# Altium schematic sheet Sheet3.SchDoc
size A; SheetNumber: 2; SheetTotal: 1
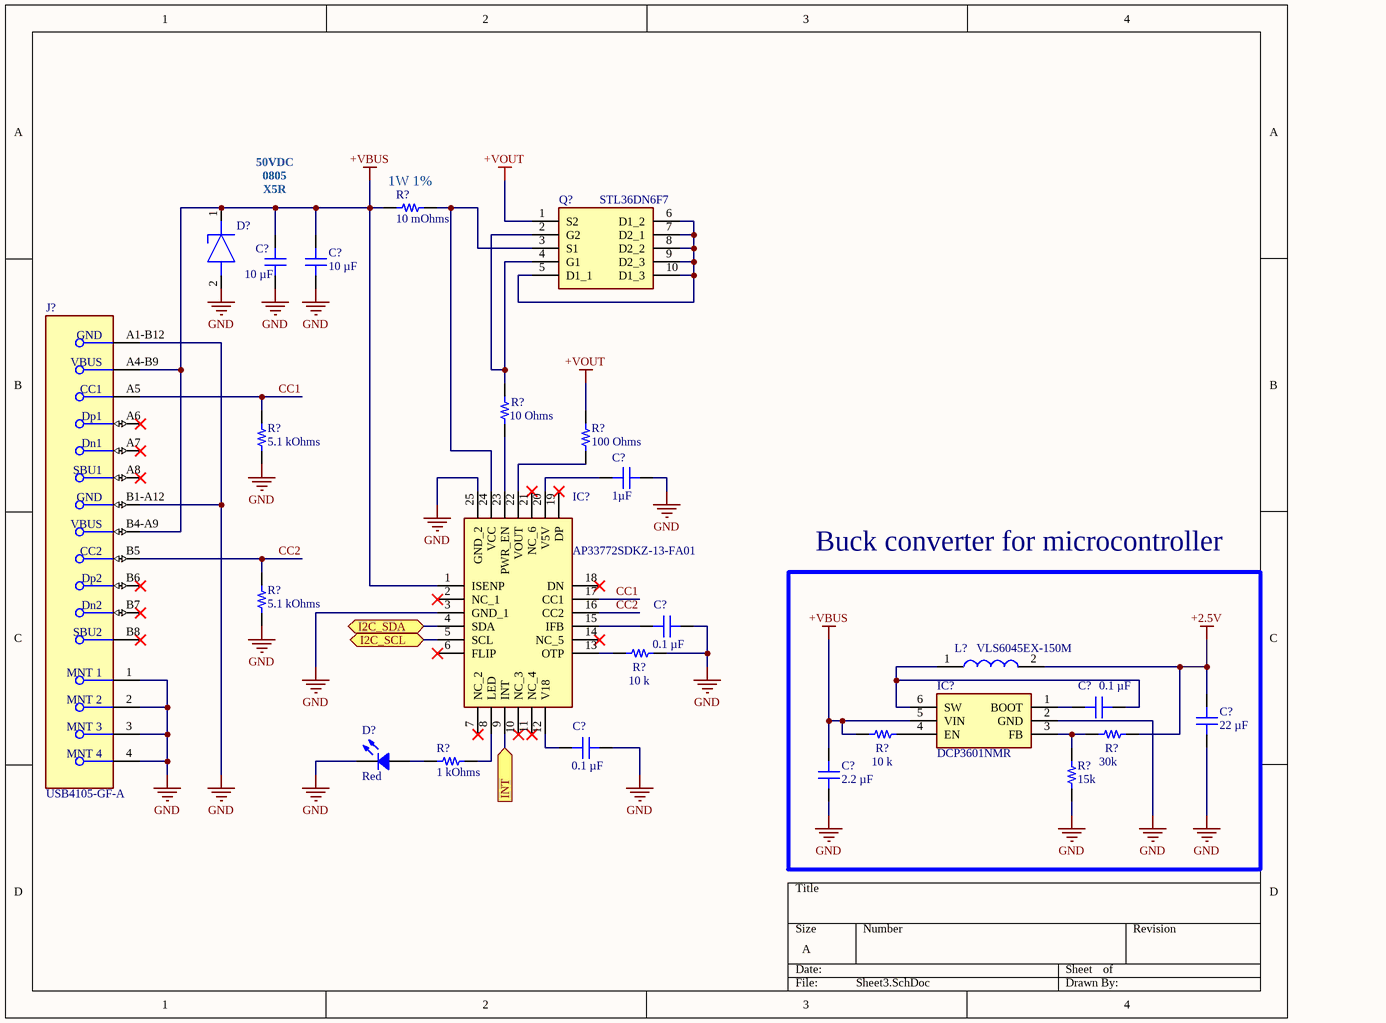
[diagram p0: Sheet3.SchDoc]

## Parts
(Parts that share a designator on the sheet are numbered #1, #2 ... from top to bottom, then left to right.)
C?#1  10 µF  [MURATA GRM21B 0805_2012]
C?#2  10 µF  [MURATA GRM21B 0805_2012]
C?#3  1µF  [CAP 0805_2012]
C?#4  0.1 µF  [CAP 0805_2012]
C?#5  0.1 µF  [CAP 0805_2012]
C?#6  22 µF  [CAP 1206_3216 - 0.8MM]
C?#7  0.1 µF  [CAP 0805_2012]
C?#8  2.2 µF  [CAP 1206_3216 - 0.8MM]
D?#1  PESD24VS1UA,115  [SOD2512X110N]  (value not drawn)
D?#2  Red  [LED 1206_3216 RED]
IC?#1  AP33772SDKZ-13-FA01  [AP33772SDKZ13FA01]
IC?#2  DCP3601NMR  [SOT95P280X125-6N]
J?  USB4105-GF-A  [FP-USB4105-GF-A-MFG]
L?  VLS6045EX-150M  [VLS6045]
Q?  STL36DN6F7  [STL36DN6F7]
R?#1  10 mOhms  [RES 1206_3216]
R?#2  10 Ohms  [RES 0805_2012]
R?#3  5.1 kOhms  [YAGEO RES 0805_2012]
R?#4  100 Ohms  [RES 0805_2012]
R?#5  5.1 kOhms  [YAGEO RES 0805_2012]
R?#6  10 k  [RES 0805_2012]
R?#7  10 k  [RES 0805_2012]
R?#8  30k  [RES 0805_2012]
R?#9  1 kOhms  [RES 0805_2012]
R?#10  15k  [RES 0805_2012]

## Blocks framed on the sheet
Buck converter for microcontroller: C?#5 C?#6 C?#8 IC?#2 L? R?#7 R?#8 R?#10

## Ports
I2C_SCL (bidir), I2C_SDA (bidir), INT (in)

## Nets
+2.5V: C?#6.2 L?.2 R?#8.2
+VBUS: C?#1.2 C?#2.2 C?#8.2 D?#1.1(K) IC?#1.1(ISENP) IC?#2.5(VIN) J?.A4-B9(VBUS) J?.B4-A9(VBUS) R?#1.1 R?#7.1
+VOUT: Q?.1(S2) R?#4.2
GND: C?#1.1 C?#2.1 C?#3.2 C?#4.1 C?#6.1 C?#7.1 C?#8.1 D?#1.2(A) D?#2.2 IC?#1.3(GND_1) IC?#1.25(GND_2) IC?#2.2(GND) J?.1(MNT_1) J?.2(MNT_2) J?.3(MNT_3) J?.4(MNT_4) J?.A1-B12(GND) J?.B1-A12(GND) R?#3.1 R?#5.1 R?#6.2 R?#10.1
CC1: IC?#1.17(CC1) J?.A5(CC1) R?#3.2
CC2: IC?#1.16(CC2) J?.B5(CC2) R?#5.2
I2C_SCL: IC?#1.5(SCL) ; port I2C_SCL
I2C_SDA: IC?#1.4(SDA) ; port I2C_SDA
INT: IC?#1.9(INT) ; port INT
NetC?#3_1: C?#3.1 IC?#1.20(V5V)
NetC?#4_2: C?#4.2 IC?#1.15(IFB)
NetC?#5_1: C?#5.1 IC?#2.1(BOOT)
NetC?#5_2: C?#5.2 IC?#2.6(SW) L?.1
NetC?#7_2: C?#7.2 IC?#1.12(V18)
NetD?#2_1: D?#2.1 R?#9.1
NetIC?#1_8: IC?#1.8(LED) R?#9.2
NetIC?#1_13: IC?#1.13(OTP) R?#6.1
NetIC?#1_22: IC?#1.22(VOUT) R?#4.1
NetIC?#1_23: IC?#1.23(PWR_EN) R?#2.1
NetIC?#1_24: IC?#1.24(VCC) Q?.3(S1) R?#1.2
NetIC?#2_3: IC?#2.3(FB) R?#8.1 R?#10.2
NetIC?#2_4: IC?#2.4(EN) R?#7.2
NetQ?_2: Q?.2(G2) Q?.4(G1) R?#2.2
NetQ?_5: Q?.5(D1_1) Q?.6(D1_2) Q?.7(D2_1) Q?.8(D2_2) Q?.9(D2_3) Q?.10(D1_3)

Not connected (* = marked no-connect by the designer): IC?#1 2(NC_1)* 6(FLIP)* 7(NC_2)* 10(NC_3)* 11(NC_4)* 14(NC_5)* 18(DN)* 19(DP)* 21(NC_6)*; J? A6(Dp1)* A7(Dn1)* A8(SBU1)* B6(Dp2)* B7(Dn2)* B8(SBU2)*

## Notes on the sheet
- 50VDC
  0805
  X5R
- (near R?#1) 1W 1%

## Library data of the parts
C?#1 C?#2 = GRM21BR61H106KE43L: CAP CER 10UF 50V X5R 0805; manufacturer: Murata Electronics; Tolerance: ±10%; Part Number: GRM21BR61H106KE43L; Capacitance: 10 µF; Applications: Mobile Devices Only; componentlink1description: Datasheet; componentlink1url: https://search.murata.co.jp/Ceramy/image/img/A01X/G101/ENG/GRM21BR61H106KE43-01A.pdf; componentlink2description: DigiKey Link; componentlink2url: https://www.digikey.com/en/products/detail/murata-electronics/GRM21BR61H106KE43L/10326316; Device Package: 0805 (2012 Metric); lastupdated: 8/27/2024 9:29:56 AM; Lifecycle Status: Active; Minimum Order: 1; Mounting Type: Surface Mount, MLCC; Operating Temperature: -55°C ~ 85°C; Package / Case: 0805 (2012 Metric); packaging: TapeAndReel; partid: 39284; Part Status: Active; price: 0.05; series: GRM; Size / Dimension: 0.079" L x 0.049" W (2.00mm x 1.25mm); Supplier 1: DigiKey; Supplier Part Number 1: 490-18663-1-ND; Temperature Coefficient: X5R; Thickness (Max): 0.057" (1.45mm); value: 10 µF; Voltage - Rated: 50V
C?#3 = 08053C105KAT2A: CAP CER 1UF 25V X7R 0805; manufacturer: AVX Corporation; Tolerance: ±10%; Part Number: 08053C105KAT2A; Capacitance: 1µF; Applications: General Purpose; componentlink1description: Datasheet; componentlink1url: http://datasheets.avx.com/X7RDielectric.pdf; componentlink2description: DigiKey Link; componentlink2url: http://digikey.com/product-detail/en/avx-corporation/08053C105KAT2A/478-5030-1-ND/1888241; Device Package: 0805 (2012 Metric); lastupdated: 9/2/2020 1:04:33 AM; Lifecycle Status: Active; Minimum Order: 1; Mounting Type: Surface Mount, MLCC; Operating Temperature: -55°C ~ 125°C; Package / Case: 0805 (2012 Metric); packaging: TapeAndReel; partid: 7289; Part Status: Active; price: 0.04; series: -; Size / Dimension: 0.079" L x 0.049" W (2.01mm x 1.25mm); Supplier 1: DigiKey; Supplier Part Number 1: 478-5030-1-ND; Temperature Coefficient: X7R; Thickness (Max): 0.037" (0.94mm); value: 1µF; Voltage - Rated: 25V
C?#4 C?#5 C?#7 = CC0805MRX7R9BB104: CAP CER 0.1UF 50V X7R 0805; manufacturer: Yageo; Tolerance: ±20%; Part Number: CC0805MRX7R9BB104; Capacitance: 0.1 µF; Applications: General Purpose; componentlink1description: Datasheet; componentlink1url: https://www.yageo.com/upload/media/product/productsearch/datasheet/mlcc/UPY-GPHC_X7R_6.3V-to-50V_18.pdf; componentlink2description: DigiKey Link; componentlink2url: https://www.digikey.com/en/products/detail/yageo/CC0805MRX7R9BB104/5884281; Device Package: 0805 (2012 Metric); lastupdated: 2/9/2024 8:16:09 PM; Lifecycle Status: Active; Minimum Order: 1; Mounting Type: Surface Mount, MLCC; Operating Temperature: -55°C ~ 125°C; Package / Case: 0805 (2012 Metric); packaging: TapeAndReel; partid: 2475; Part Status: Active; price: 0.01; series: CC; Size / Dimension: 0.079" L x 0.049" W (2.00mm x 1.25mm); Supplier 1: DigiKey; Supplier Part Number 1: 311-4351-1-ND; Temperature Coefficient: X7R; Thickness (Max): 0.037" (0.95mm); value: 0.1 µF; Voltage - Rated: 50V
C?#6 = CL31A226MOCLNNC: CAP CER 22UF 16V X5R 1206; manufacturer: Samsung Electro-Mechanics; Tolerance: ±20%; Part Number: CL31A226MOCLNNC; Capacitance: 22 µF; Applications: General Purpose; componentlink1description: Datasheet; componentlink1url: http://www.samsungsem.com/kr/support/product-search/mlcc/CL31A226MOCLNNC.jsp; componentlink2description: DigiKey Link; componentlink2url: https://www.digikey.com/en/products/detail/samsung-electro-mechanics/CL31A226MOCLNNC/3888386; Device Package: 1206 (3216 Metric); Features: Low Profile; lastupdated: 6/4/2024 7:10:40 PM; Lifecycle Status: Active; Minimum Order: 1; Mounting Type: Surface Mount, MLCC; Operating Temperature: -55°C ~ 85°C; Package / Case: 1206 (3216 Metric); packaging: TapeAndReel; partid: 19106; Part Status: Active; price: 0.04; series: CL; Size / Dimension: 0.126" L x 0.063" W (3.20mm x 1.60mm); Supplier 1: DigiKey; Supplier Part Number 1: 1276-2728-1-ND; Temperature Coefficient: X5R; Thickness (Max): 0.037" (0.95mm); value: 22 µF; Voltage - Rated: 16V
C?#8 = GCJ31CR71H225KA12K: CAP CER 2.2UF 50V X7R 1206; manufacturer: Murata Electronics; Tolerance: ±10%; Part Number: GCJ31CR71H225KA12K; Capacitance: 2.2 µF; Applications: Automotive, Boardflex Sensitive; componentlink1description: Datasheet; componentlink1url: https://search.murata.co.jp/Ceramy/image/img/A01X/G101/ENG/GCJ31CR71H225KA12-01.pdf; componentlink2description: DigiKey Link; componentlink2url: https://www.digikey.com/en/products/detail/murata-electronics/GCJ31CR71H225KA12K/11618649; Device Package: 1206 (3216 Metric); Features: Soft Termination; lastupdated: 6/4/2024 7:10:16 PM; Lifecycle Status: Active; Minimum Order: 1; Mounting Type: Surface Mount, MLCC; Operating Temperature: -55°C ~ 125°C; Package / Case: 1206 (3216 Metric); packaging: TapeAndReel; partid: 30270; Part Status: Active; price: 0.06; Ratings: AEC-Q200; series: GCJ; Size / Dimension: 0.126" L x 0.063" W (3.20mm x 1.60mm); Supplier 1: DigiKey; Supplier Part Number 1: 490-GCJ31CR71H225KA12KCT-ND; Temperature Coefficient: X7R; Thickness (Max): 0.075" (1.90mm); value: 2.2 µF; Voltage - Rated: 50V
D?#1 = PESD24VS1UA,115: Diode ESD (Uni-directional); Manufacturer_Name: Nexperia; Datasheet Link: https://assets.nexperia.com/documents/data-sheet/PESD24VS1UA.pdf; Height: 1.1mm; Manufacturer_Part_Number: PESD24VS1UA,115; Mouser Part Number: 771-PESD24VS1UA115; Mouser Price/Stock: https://www.mouser.co.uk/ProductDetail/Nexperia/PESD24VS1UA115?qs=A1cBxND5mHKZ%252BhkKKiwSEA%3D%3D; Arrow Part Number: PESD24VS1UA,115; Arrow Price/Stock: https://www.arrow.com/en/products/pesd24vs1ua115/nexperia
D?#2 = 5990210007F: LED RED 1206 SMD; Manufacturer: Dialight; Configuration: Standard; Current - Test: 20mA; Lens Color: 0.80mm; Lens Size: 2.00mm x 1.60mm; Lens Style: Rectangle with Flat Top; Millicandela Rating: 29mcd; Viewing Angle: 140°; Voltage - Forward (Vf) (Typ): 2.1V; Wavelength - Dominant: 633nm; Part Number: 5990210007F; Color: Red; ComponentLink1Description: Datasheet; ComponentLink1URL: http://www.dialightsignalsandcomponents.com/Assets/Brochures_And_Catalogs/Indication/CBI_SMD_new/Dialight_CBI_data_599-1206_Apr2018.pdf; ComponentLink2Description: DigiKey Link; ComponentLink2URL: https://www.digikey.com/en/products/detail/dialight/5990210007F/9385415; Device Package: 1206 (3216 Metric); Height (Max): 0.80mm; LastUpdated: 6/3/2024 8:00:41 PM; Lifecycle Status: Active; Minimum Order: 1; Mounting Type: Surface Mount; Package / Case: 1206 (3216 Metric); Packaging: TapeAndReel; PartId: 188; Part Status: Active; Price: 0.04; Series: 599; Size / Dimension: 3.20mm L x 1.60mm W; Supplier 1: DigiKey; Supplier Part Number 1: 350-4360-1-ND; Supplier Device Package: 1206; Value: Red
IC?#1 = AP33772SDKZ-13-FA01: Integrated Circuit; Manufacturer_Name: Diodes Incorporated; Datasheet Link: https://www.diodes.com/datasheet/download/AP33772S.pdf; Height: 0.8mm; Manufacturer_Part_Number: AP33772SDKZ-13-FA01; Mouser Part Number: 621-P33772SDKZ13FA01; Mouser Price/Stock: https://www.mouser.co.uk/ProductDetail/Diodes-Incorporated/AP33772SDKZ-13-FA01?qs=2wMNvWM5ZX4CLYQ4%252BLyimw%3D%3D
IC?#2 = DCP3601NMR: Integrated Circuit; Manufacturer_Name: STMicroelectronics; Datasheet Link: https://www.st.com/resource/en/datasheet/dcp3601.pdf; Height: 1.25mm; Manufacturer_Part_Number: DCP3601NMR; Mouser Part Number: 511-DCP3601NMR; Mouser Price/Stock: https://www.mouser.co.uk/ProductDetail/STMicroelectronics/DCP3601NMR?qs=VVKQmw408U%252BduQkqjRfAvg%3D%3D
J? = CMP-002-00071-1: Conn USB 2.0 Type C RCP 24 POS 0.3mm/0.5mm Solder RA SMD 24 Terminal 1 Port T/R
L? = VLS6045EX-150M: Inductor; Manufacturer_Name: TDK; Datasheet Link: https://product.tdk.com/system/files/dam/doc/product/inductor/inductor/smd/catalog/inductor_commercial_power_vls6045ex_en.pdf; Manufacturer_Part_Number: VLS6045EX-150M; Mouser Part Number: 810-VLS6045EX-150M; Mouser Price/Stock: https://www.mouser.co.uk/ProductDetail/TDK/VLS6045EX-150M?qs=oF%2FSscNnLpDh4m%2FVdQ%2FgKQ%3D%3D; Arrow Part Number: VLS6045EX-150M; Arrow Price/Stock: https://www.arrow.com/en/products/vls6045ex-150m/tdk?region=nac
Q? = STL36DN6F7: MOSFET (N-Channel); Manufacturer_Name: STMicroelectronics; Datasheet Link: https://www.digikey.com/en/products/detail/stmicroelectronics/STL36DN6F7/7360914?msockid=3bdc366bbe0663d83c1223c0bf3662a6; Manufacturer_Part_Number: STL36DN6F7; Mouser Part Number: 511-STL36DN6F7; Mouser Price/Stock: https://www.mouser.co.uk/ProductDetail/STMicroelectronics/STL36DN6F7/?qs=u4fy%2FsgLU9MwLM2KeqBprA%3D%3D; Arrow Part Number: STL36DN6F7; Arrow Price/Stock: https://www.arrow.com/en/products/stl36dn6f7/stmicroelectronics
R?#1 = TLRP2B10WR010FTD: RES 0.01 OHM 1% 1W 1206; Manufacturer: TE Connectivity Passive Product; Temperature Coefficient: ±75ppm/°C; Part Number: TLRP2B10WR010FTD; ComponentLink1Description: Datasheet; ComponentLink1URL: https://www.te.com/commerce/DocumentDelivery/DDEController?Action=srchrtrv&DocNm=1773449-4&DocType=DS&DocLang=English; ComponentLink2Description: DigiKey Link; ComponentLink2URL: https://www.digikey.com/en/products/detail/te-connectivity-passive-product/TLRP2B10WR010FTD/14652424; Composition: Metal Element; Device Package: 1206 (3216 Metric); Features: Anti-Sulfur, Automotive AEC-Q200, Current Sense; Height - Seated (Max): 0.026" (0.65mm); LastUpdated: 2/9/2024 8:53:14 PM; Lifecycle Status: Active; Minimum Order: 1; Number of Terminations: 2; Operating Temperature: -55°C ~ 170°C; Package / Case: 1206 (3216 Metric); Packaging: TapeAndReel; PartId: 67637; Part Status: Active; Power (Watts): 1W; Price: 0.13; Ratings: AEC-Q200; Resistance: 10 mOhms; Series: TLRP; Size / Dimension: 0.124" L x 0.057" W (3.15mm x 1.45mm); Supplier 1: DigiKey; Supplier Part Number 1: 1712-TLRP2B10WR010FTDCT-ND; Supplier Device Package: 1206; Tolerance: ±1%; Value: 10 mOhms
R?#2 = CRCW080510R0FKEAC: RES 10 OHM 1% 1/8W 0805; Manufacturer: Vishay Dale; Power (Watts): 0.125W, 1/8W; Temperature Coefficient: ±100ppm/°C; Part Number: CRCW080510R0FKEAC; Value: 10 Ohms; ComponentLink1Description: Datasheet; ComponentLink1URL: http://www.vishay.com/docs/28773/crcwce3.pdf; ComponentLink2Description: DigiKey Link; ComponentLink2URL: https://www.digikey.com/en/products/detail/vishay-dale/CRCW080510R0FKEAC/7928554; Composition: Thick Film; Device Package: 0805 (2012 Metric); Height - Seated (Max): 0.024" (0.60mm); LastUpdated: 2/8/2024 9:01:19 PM; Lifecycle Status: Active; Minimum Order: 1; Number of Terminations: 2; Operating Temperature: -55°C ~ 155°C; Package / Case: 0805 (2012 Metric); Packaging: TapeAndReel; PartId: 46232; Part Status: Active; Price: 0.01; Resistance: 10 Ohms; Series: CRCW-C; Size / Dimension: 0.079" L x 0.049" W (2.00mm x 1.25mm); Supplier 1: DigiKey; Supplier Part Number 1: 541-4132-1-ND; Supplier Device Package: 0805; Tolerance: ±1%
R?#3 R?#5 = RT0805BRD075K1L: RES SMD 5.1K OHM 0.1% 1/8W 0805; Manufacturer: Yageo; Power (Watts): 0.125W, 1/8W; Temperature Coefficient: ±25ppm/°C; Part Number: RT0805BRD075K1L; Value: 5.1 kOhms; ComponentLink1Description: Datasheet; ComponentLink1URL: https://www.yageo.com/upload/media/product/productsearch/datasheet/rchip/PYu-RT_1-to-0.01_RoHS_L_11.pdf; ComponentLink2Description: DigiKey Link; ComponentLink2URL: https://www.digikey.com/en/products/detail/yageo/RT0805BRD075K1L/1075977; Composition: Thin Film; Device Package: 0805 (2012 Metric); Height - Seated (Max): 0.024" (0.60mm); LastUpdated: 7/25/2024 9:20:25 AM; Lifecycle Status: Active; Minimum Order: 1; Number of Terminations: 2; Operating Temperature: -55°C ~ 155°C; Package / Case: 0805 (2012 Metric); Packaging: TapeAndReel; PartId: 32968; Part Status: Active; Price: 0.04; Resistance: 5.1 kOhms; Series: RT; Size / Dimension: 0.079" L x 0.049" W (2.00mm x 1.25mm); Supplier 1: DigiKey; Supplier Part Number 1: YAG1938CT-ND; Supplier Device Package: 0805; Tolerance: ±0.1%
R?#4 = CRCW0805100RFKEAC: RES 100 OHM 1% 1/8W 0805; Manufacturer: Vishay Dale; Power (Watts): 0.125W, 1/8W; Temperature Coefficient: ±100ppm/°C; Part Number: CRCW0805100RFKEAC; Value: 100 Ohms; ComponentLink1Description: Datasheet; ComponentLink1URL: http://www.vishay.com/docs/28773/crcwce3.pdf; ComponentLink2Description: DigiKey Link; ComponentLink2URL: https://www.digikey.com/en/products/detail/vishay-dale/CRCW0805100RFKEAC/7928401; Composition: Thick Film; Device Package: 0805 (2012 Metric); Height - Seated (Max): 0.024" (0.60mm); LastUpdated: 2/8/2024 9:01:05 PM; Lifecycle Status: Active; Minimum Order: 1; Number of Terminations: 2; Operating Temperature: -55°C ~ 155°C; Package / Case: 0805 (2012 Metric); Packaging: TapeAndReel; PartId: 47768; Part Status: Active; Price: 0.01; Resistance: 100 Ohms; Series: CRCW-C; Size / Dimension: 0.079" L x 0.049" W (2.00mm x 1.25mm); Supplier 1: DigiKey; Supplier Part Number 1: 541-3979-1-ND; Supplier Device Package: 0805; Tolerance: ±1%
R?#6 R?#7 = RNCS0805BKE10K0: RES 10K OHM 0.1% 1/10W 0805; Manufacturer: Stackpole Electronics Inc; Power (Watts): 0.1W, 1/10W; Resistance: 10 kOhms; Temperature Coefficient: ±25ppm/°C; Part Number: RNCS0805BKE10K0; Value: 10 k; ComponentLink1Description: Datasheet; ComponentLink1URL: https://www.seielect.com/catalog/sei-rncs_rnch.pdf; ComponentLink2Description: DigiKey Link; ComponentLink2URL: https://www.digikey.com/en/products/detail/stackpole-electronics-inc/RNCS0805BKE10K0/1800067; Composition: Thin Film; Device Package: 0805 (2012 Metric); Features: Anti-Corrosive, Automotive AEC-Q200, Moisture Resistant; Height - Seated (Max): 0.026" (0.65mm); LastUpdated: 2/8/2024 9:02:39 PM; Lifecycle Status: Active; Minimum Order: 1; Number of Terminations: 2; Operating Temperature: -55°C ~ 155°C; Package / Case: 0805 (2012 Metric); Packaging: TapeAndReel; PartId: 27713; Part Status: Active; Price: 0.07; Ratings: AEC-Q200; Series: RNCS; Size / Dimension: 0.079" L x 0.049" W (2.00mm x 1.25mm); Supplier 1: DigiKey; Supplier Part Number 1: RNCS0805BKE10K0CT-ND; Supplier Device Package: 0805; Tolerance: ±0.1%
R?#8 = CRCW080573K2FKEA: RES SMD 73.2K OHM 1% 1/8W 0805; Manufacturer: Vishay Dale; Power (Watts): 0.125W, 1/8W; Resistance: 73.2 kOhms; Temperature Coefficient: ±100ppm/°C; Part Number: CRCW080573K2FKEA; Value: 30k; ComponentLink1Description: Datasheet; ComponentLink1URL: http://www.vishay.com/docs/20035/dcrcwe3.pdf; ComponentLink2Description: DigiKey Link; ComponentLink2URL: https://www.digikey.com/en/products/detail/vishay-dale/CRCW080573K2FKEA/1175850; Composition: Thick Film; Device Package: 0805 (2012 Metric); Features: Automotive AEC-Q200; Height - Seated (Max): 0.020" (0.50mm); LastUpdated: 2/8/2024 9:02:35 PM; Lifecycle Status: Active; Minimum Order: 1; Number of Terminations: 2; Operating Temperature: -55°C ~ 155°C; Package / Case: 0805 (2012 Metric); Packaging: TapeAndReel; PartId: 28591; Part Status: Active; Price: 0.01; Ratings: AEC-Q200; Series: CRCW; Size / Dimension: 0.079" L x 0.049" W (2.00mm x 1.25mm); Supplier 1: DigiKey; Supplier Part Number 1: 541-73.2KCCT-ND; Supplier Device Package: 0805; Tolerance: ±1%
R?#9 = Y40221K00000T0R: RES SMD 1K OHM 0.01% 1/5W 0805; Manufacturer: Vishay Foil Resistors (Division of Vishay Precision Group); Power (Watts): 0.2W, 1/5W; Temperature Coefficient: ±0.2ppm/°C; Part Number: Y40221K00000T0R; Value: 1 kOhms; ComponentLink1Description: Datasheet; ComponentLink1URL: http://www.vishaypg.com/docs/63209/FRSM.pdf; ComponentLink2Description: DigiKey Link; ComponentLink2URL: https://www.digikey.com/en/products/detail/vishay-foil-resistors-division-of-vishay-precision-group/Y40221K00000T0R/2640995; Composition: Metal Foil; Device Package: 0805 (2012 Metric); Features: Moisture Resistant, Non-Inductive; Height - Seated (Max): 0.025" (0.64mm); LastUpdated: 2/8/2024 9:02:07 PM; Lifecycle Status: Active; Minimum Order: 1; Number of Terminations: 2; Operating Temperature: -55°C ~ 150°C; Package / Case: 0805 (2012 Metric); Packaging: TapeAndReel; PartId: 34935; Part Status: Active; Price: 12.16; Resistance: 1 kOhms; Series: FRSM; Size / Dimension: 0.080" L x 0.050" W (2.03mm x 1.27mm); Supplier 1: DigiKey; Supplier Part Number 1: Y4022-1.0KBCT-ND; Supplier Device Package: 0805; Tolerance: ±0.01%
R?#10 = CRGP0805F15K: RES 15K OHM 1% 1/3W 0805; Manufacturer: TE Connectivity Passive Product; Power (Watts): 0.333W, 1/3W; Resistance: 15 kOhms; Temperature Coefficient: ±100ppm/°C; Part Number: CRGP0805F15K; Value: 15k; ComponentLink1Description: Datasheet; ComponentLink1URL: https://www.te.com/commerce/DocumentDelivery/DDEController?Action=srchrtrv&DocNm=9-1773463-9&DocType=DS&DocLang=English; ComponentLink2Description: DigiKey Link; ComponentLink2URL: https://www.digikey.com/en/products/detail/te-connectivity-passive-product/CRGP0805F15K/8577093; Composition: Thick Film; Device Package: 0805 (2012 Metric); Features: Pulse Withstanding; Height - Seated (Max): 0.026" (0.65mm); LastUpdated: 2/8/2024 9:02:34 PM; Lifecycle Status: Active; Minimum Order: 1; Number of Terminations: 2; Operating Temperature: -55°C ~ 155°C; Package / Case: 0805 (2012 Metric); Packaging: TapeAndReel; PartId: 28775; Part Status: Active; Price: 0.02; Series: CRGP; Size / Dimension: 0.079" L x 0.049" W (2.00mm x 1.25mm); Supplier 1: DigiKey; Supplier Part Number 1: A130491CT-ND; Supplier Device Package: 0805; Tolerance: ±1%